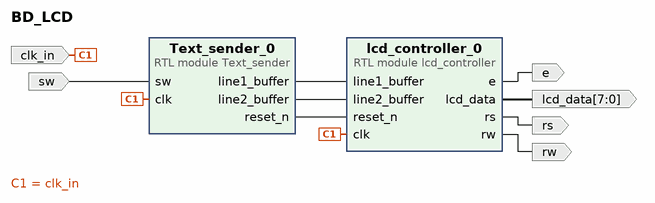
[diagram p0: block diagram of the top level]
# Vivado block design BD_LCD, xc7z020clg400-1, Vivado 2022.1
create_bd_design BD_LCD

create_bd_port -dir O rw
create_bd_port -dir I -type clk clk_in
set_property -dict {CONFIG.FREQ_HZ 125000000} [get_bd_ports clk_in]
create_bd_port -dir O rs
create_bd_port -dir O e
create_bd_port -dir O -from 7 -to 0 -type data lcd_data
create_bd_port -dir I sw

create_bd_cell -type module -reference lcd_controller lcd_controller_0
create_bd_cell -type module -reference Text_sender Text_sender_0

# ---- connections ----

connect_bd_net [get_bd_pins Text_sender_0/line1_buffer] [get_bd_pins lcd_controller_0/line1_buffer]
connect_bd_net [get_bd_pins Text_sender_0/line2_buffer] [get_bd_pins lcd_controller_0/line2_buffer]
connect_bd_net [get_bd_pins Text_sender_0/reset_n] [get_bd_pins lcd_controller_0/reset_n]
connect_bd_net [get_bd_ports clk_in] [get_bd_pins lcd_controller_0/clk] [get_bd_pins Text_sender_0/clk]
connect_bd_net [get_bd_pins lcd_controller_0/e] [get_bd_ports e]
connect_bd_net [get_bd_pins lcd_controller_0/lcd_data] [get_bd_ports lcd_data]
connect_bd_net [get_bd_pins lcd_controller_0/rs] [get_bd_ports rs]
connect_bd_net [get_bd_pins lcd_controller_0/rw] [get_bd_ports rw]
connect_bd_net [get_bd_ports sw] [get_bd_pins Text_sender_0/sw]

validate_bd_design
save_bd_design
